# EAGLE design Capstone V7 (EAGLE 9.6.2)
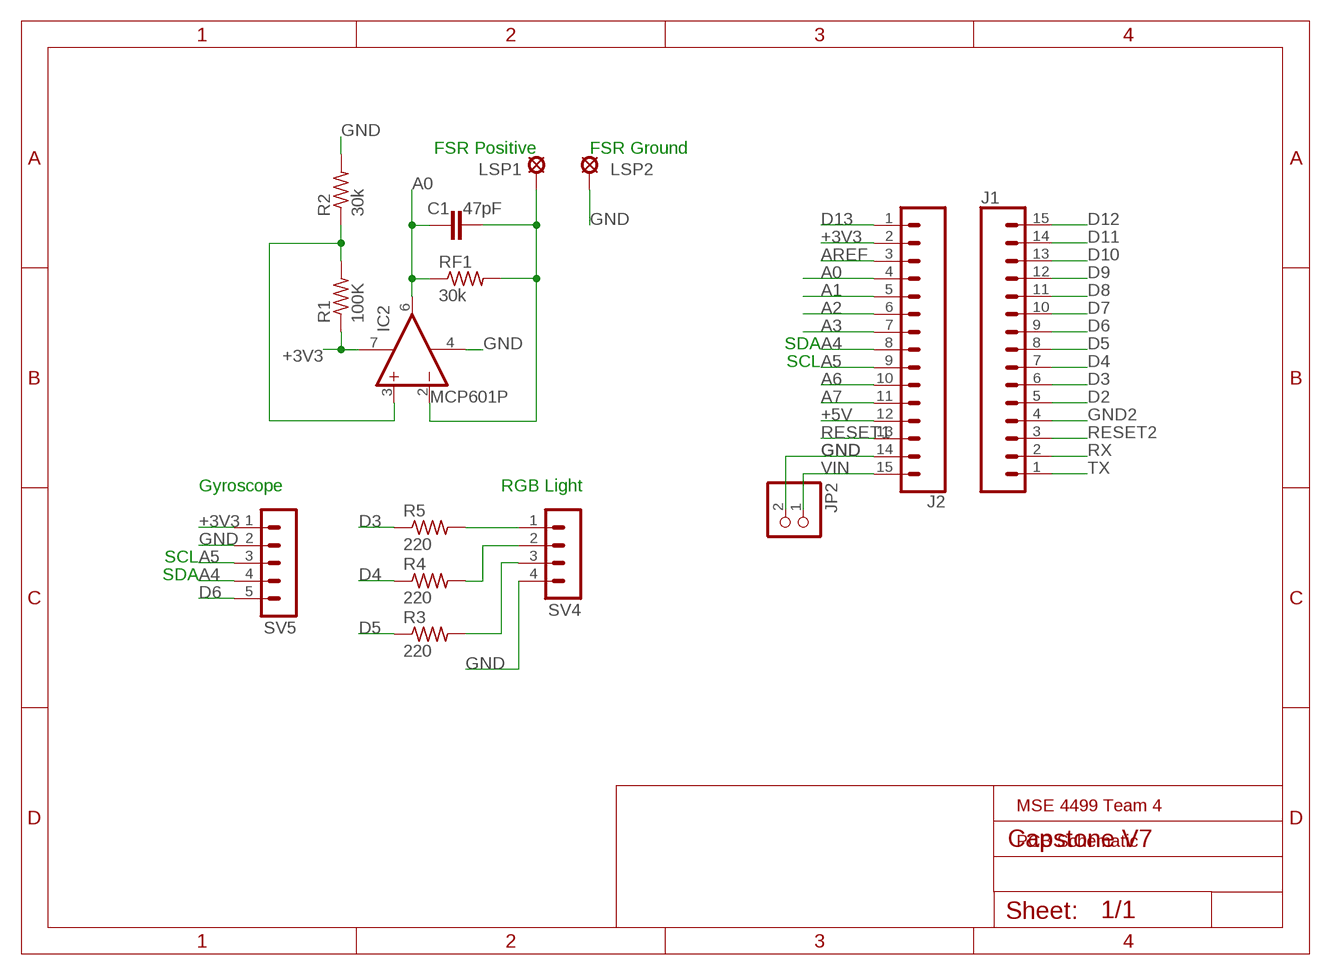
[diagram p0: schematic, sheet 1]

## Parts
C1  47pF  C2,5-3  [C2.5-3]
IC2  MCP601P  [DIL08]
J1  CONN_15  [1X15]
J2  CONN_15  [1X15]
JP2  PINHD-1X2  [1X02]
LSP1  LSP10  [LSP10]
LSP2  LSP10  [LSP10]
R1  100K  R-US_0204/7  [0204/7]
R2  30k  R-US_0204/7  [0204/7]
R3  220  R-US_0204/7  [0204/7]
R4  220  R-US_0204/7  [0204/7]
R5  220  R-US_0204/7  [0204/7]
RF1  30k  R-US_0204/7  [0204/7]
SV4  MA04-1  [MA04-1]
SV5  MA05-1  [MA05-1]

## Nets
+3V3: IC2.7(V+) J2.2 R1.1 SV5.1
+5V: J2.12
A0: C1.1 IC2.6(OUT) J2.4 RF1.1
A1: J2.5
A2: J2.6
A3: J2.7
A4: J2.8 SV5.4
A5: J2.9 SV5.3
A6: J2.10
A7: J2.11
AREF: J2.3
D2: J1.5
D3: J1.6 R5.1
D4: J1.7 R4.1
D5: J1.8 R3.1
D6: J1.9 SV5.5
D7: J1.10
D8: J1.11
D9: J1.12
D10: J1.13
D11: J1.14
D12: J1.15
D13: J2.1
GND: IC2.4(V-) J2.14 JP2.2 LSP2.MP R2.2 SV4.4 SV5.2
GND2: J1.4
N$1: R5.2 SV4.1
N$2: IC2.3(+IN) R1.2 R2.1
N$3: R4.2 SV4.2
N$5: R3.2 SV4.3
N$6: C1.2 IC2.2(-IN) LSP1.MP RF1.2
RESET1: J2.13
RESET2: J1.3
RX: J1.2
TX: J1.1
VIN: J2.15 JP2.1

## Notes on the sheet
- FSR Positive | FSR Ground
- SDA
- SCL
- Gyroscope | RGB Light
- SCL
- SDA
- MSE 4499 Team 4
- PCB Schematic

## Library data of the parts
C1 = capacitor-wima:C: CAPACITOR naming: grid - package width
IC2 = linear:MCP601: Single Op Amp 2.7V to 6.0V Single Supply CMOS Source: http://ww1.microchip.com/downloads/en/DeviceDoc/21314g.pdf
J1 J2 = SparkFun-Connectors:CONN_15: Multi connection point. Often used as Generic Header-pin footprint for 0.1 inch spaced/style header connections On any of the 0.1 inch spaced packages, you can populate with these: Break Away Headers - Straight <https://www.sparkfun.com/products/116> (PRT-00116) Break Away Male Headers - Right Angle <https://www.sparkfun.com/products/553> (PRT-00553) Female Headers <https://www.sparkfun.com/products/115> (PRT-00115) Break Away Headers - Machine Pin <https://www.sparkfun.com/products/117> (PRT-00117) Break Away Female Headers - Swiss Machine Pin <https://www.sparkfun.com/products/743> (PRT-00743) For SCREWTERMINALS and SPRING TERMINALS visit here: Screw Terimnals on SparkFun.com <https://www.sparkfun.com/search/results?term=Screw+Terminals> (5mm/3.5mm/2.54mm spacing) This device is also useful as a general connection point to wire up your design to another part of your project. Our various solder wires solder well into these plated through hole pads. Hook-Up Wire - Assortment (Stranded, 22 AWG) <https://www.sparkfun.com/products/11375> (PRT-11375) Hook-Up Wire - Assortment (Solid Core, 22 AWG) <https://www.sparkfun.com/products/11367> (PRT-11367) View the entire wire category on our website here <https://www.sparkfun.com/categories/141> Special notes: Molex polarized connector foot print use with SKU : PRT-08231 with associated crimp pins and housings. 1MM SMD Version SKU: PRT-10208 NOTES ON THE VARIANTS LOCK and LOCK_LONGPADS... This footprint was designed to help hold the alignment of a through-hole component (i.e. 6-pin header) while soldering it into place. You may notice that each hole has been shifted either up or down by 0.005 of an inch from it's more standard position (which is a perfectly straight line). This slight alteration caused the pins (the squares in the middle) to touch the edges of the holes. Because they are alternating, it causes a "brace" to hold the component in place. 0.005 has proven to be the perfect amount of "off-center" position when using our standard breakaway headers. Although looks a little odd when you look at the bare footprint, once you have a header in there, the alteration is very hard to notice. Also,if you push a header all the way into place, it is covered up entirely on the bottom side.
JP2 = pinhead:PINHD-1X2: PIN HEADER
LSP1 LSP2 = solpad:LSP10: SOLDER PAD drill 1.0 mm, distributor Buerklin, 12H555
R1-R5 RF1 = resistor:R-US_: RESISTOR, American symbol
SV4 = con-lstb:MA04-1: PIN HEADER; OC_FARNELL: unknown; OC_NEWARK: unknown
SV5 = con-lstb:MA05-1: PIN HEADER; OC_FARNELL: unknown; OC_NEWARK: unknown

## Net classes
0 default: width 0.19 mm, drill 0.19 mm

## Board
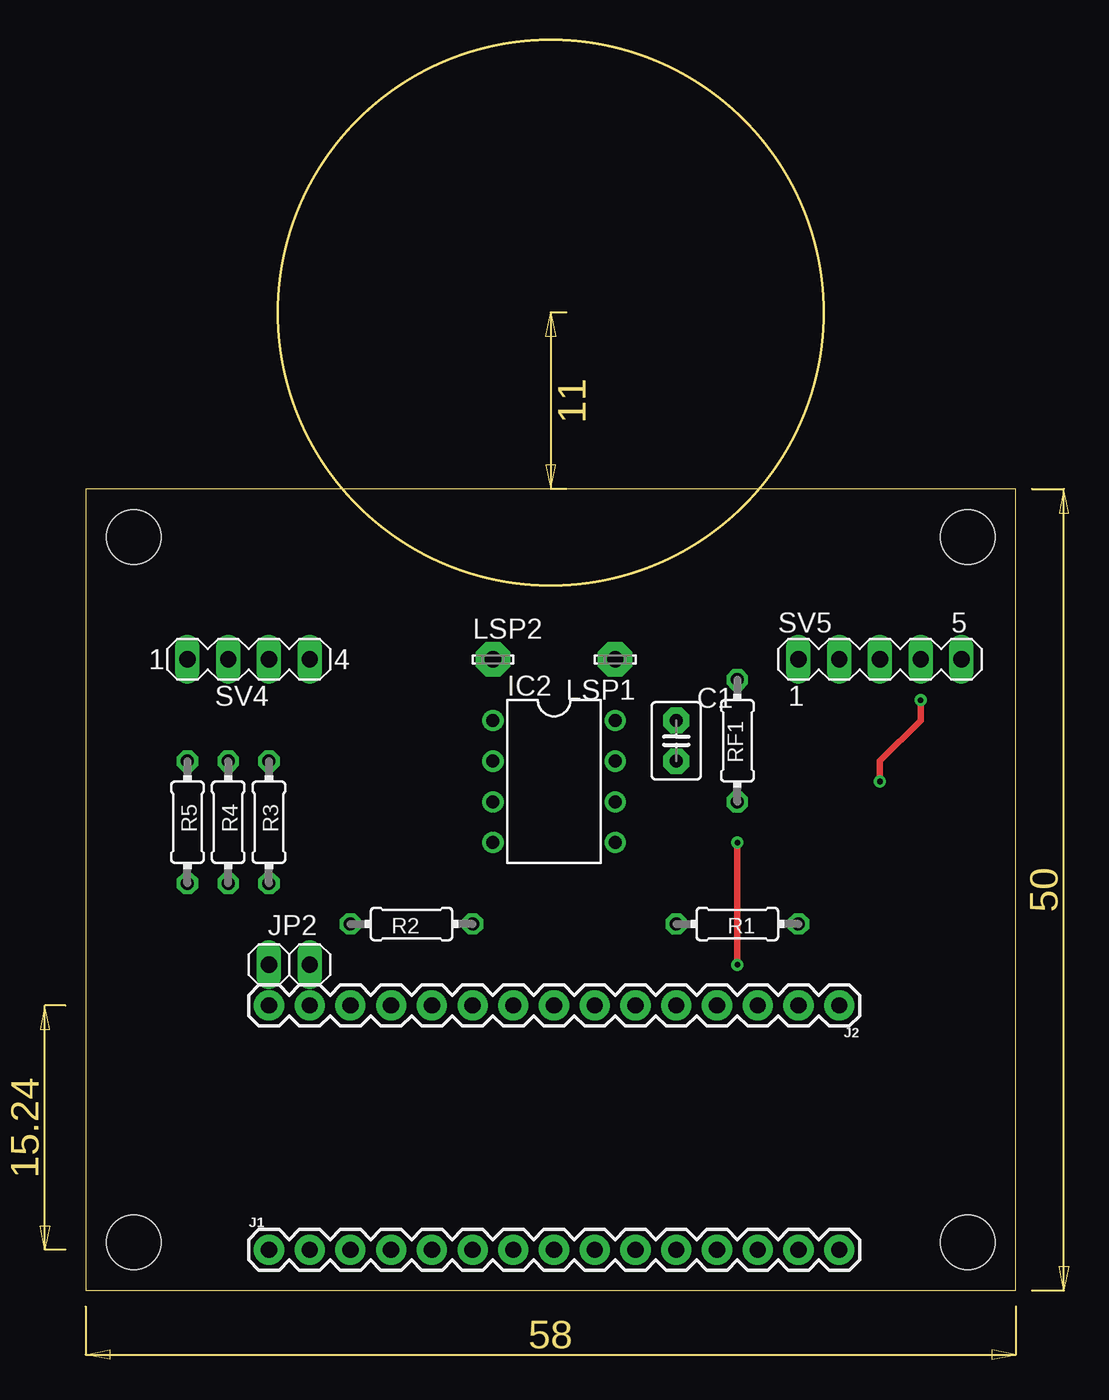
[diagram p1: board, top side]
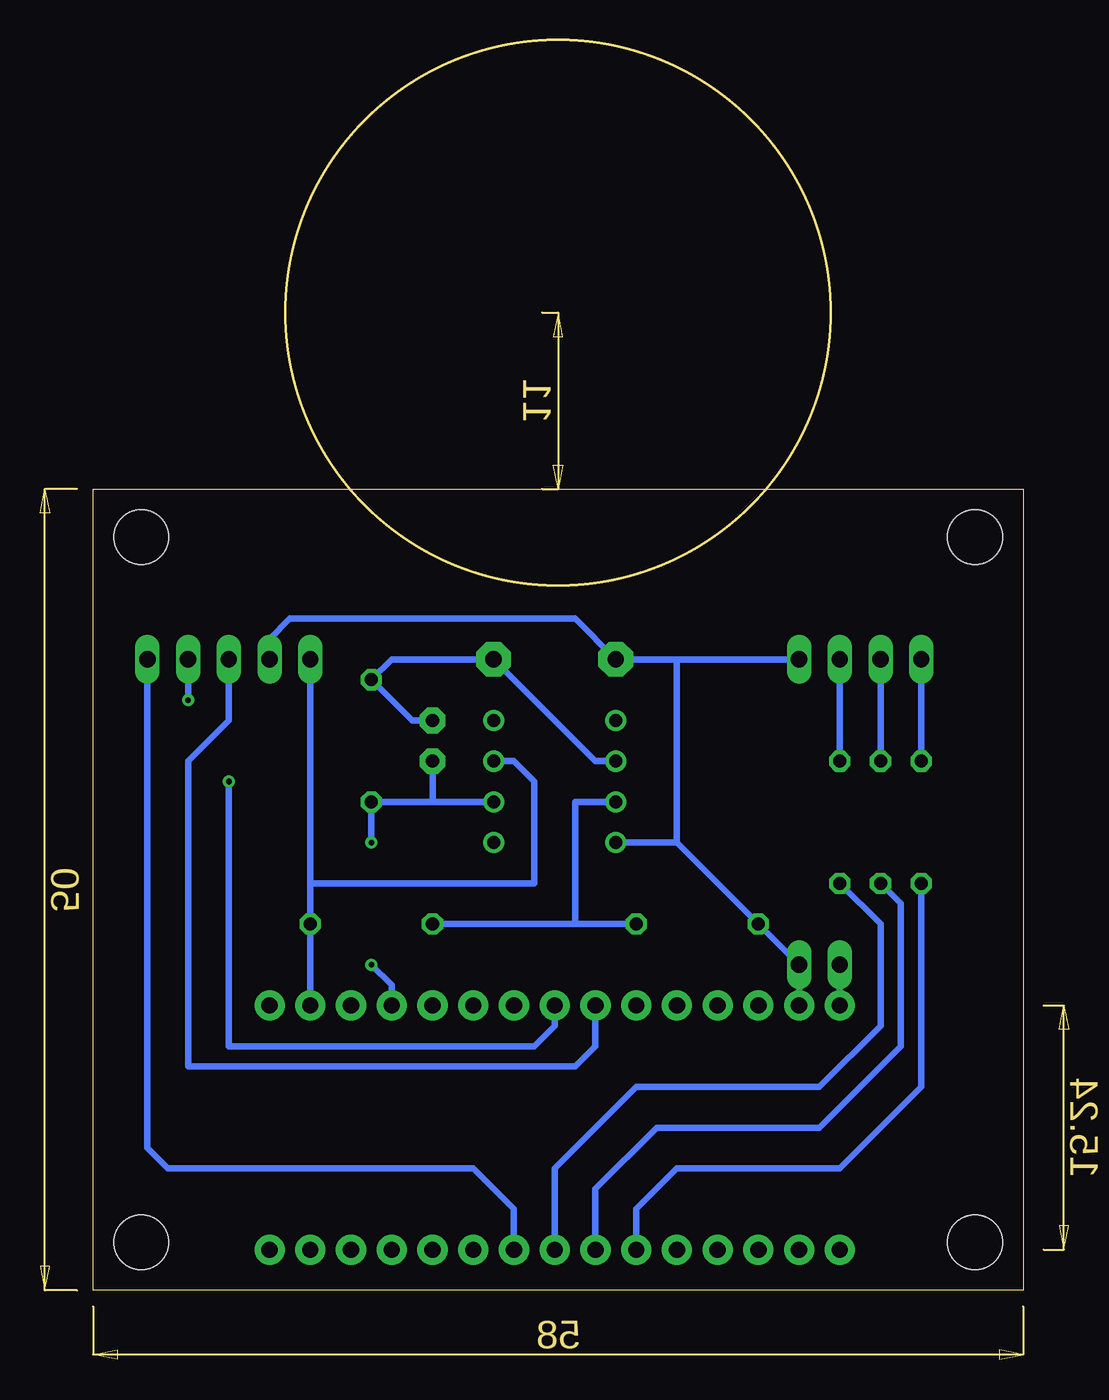
[diagram p2: board, bottom side, seen from below]

Size 58 x 78 mm. Coordinates in mm from the lower left corner, seen from the top.
Outline: 0,0 58,0 58,50 0,50 0,0
Outline: circle at 29,61 radius 17
Copper layers (1*16): Top 0.035mm / dielectric 1.5mm / Bottom 0.035mm
Design rules "default *": minimum track width 6mil, minimum drill 0.35mm, track to track 6mil, track to pad 6mil, pad to pad 6mil, via to via 6mil, smd to smd 6mil, copper to edge 40mil, drill to drill 6mil, minimum pad ring 10mil, minimum via ring 8mil, stop-mask expansion 4mil, vias tented up to drill 0mil, thermal gap 10mil
Holes 3.4 mm at 3,47 55,47 55,3 3,3
Holes 34 mm at 29,61

### Footprints (pad centres in the part's own frame; a part is rotated, then mirrored left to right if it is on the bottom)
C2.5-3 = drill 0.813 pad 1.6 octagon: 1 -1.27,0; 2 1.27,0
DIL08 = drill 0.813 pad 1.27: 1 -3.81,-3.81; 2 -1.27,-3.81; 3 1.27,-3.81; 4 3.81,-3.81; 5 3.81,3.81; 6 1.27,3.81; 7 -1.27,3.81; 8 -3.81,3.81
1X15 = drill 1.016 pad 1.88: 1 0,0; 2 2.54,0; 3 5.08,0; 4 7.62,0; 5 10.16,0; 6 12.7,0; 7 15.24,0; 8 17.78,0; 9 20.32,0; 10 22.86,0; 11 25.4,0; 12 27.94,0; 13 30.48,0; 14 33.02,0; 15 35.56,0
1X02 = drill 1.016 long: 1 -1.27,0; 2 1.27,0
LSP10 = drill 1.016 pad 2.159 octagon: MP 0,0
0204/7 = drill 0.813 octagon: 1 -3.81,0; 2 3.81,0
MA04-1 = drill 1.016 long: 1 -3.81,0; 2 -1.27,0; 3 1.27,0; 4 3.81,0
MA05-1 = drill 1.016 long: 1 -5.08,0; 2 -2.54,0; 3 0,0; 4 2.54,0; 5 5.08,0

### Placement (x,y rotation side)
C1  36.83,34.29 90 top
IC2  29.21,31.75 270 top
J1  11.43,2.54 0 top
J2  46.99,17.78 180 top
JP2  12.7,20.32 0 top
LSP1  33.02,39.37 0 top
LSP2  25.4,39.37 0 top
R1  40.64,22.86 180 top
R2  20.32,22.86 180 top
R3  11.43,29.21 90 top
R4  8.89,29.21 90 top
R5  6.35,29.21 90 top
RF1  40.64,34.29 90 top
SV4  10.16,39.37 0 top
SV5  49.53,39.37 0 top

### Tracks (layer width: path | path; a pad name or v marks a point on that pad's centre or on a via)
+3V3
  Bottom 0.406: 44.45,25.4 30.48,25.4 30.48,31.75 31.75,33.02 IC2.7 | J2.2 R1.1 44.45,25.4 | 44.45,25.4 SV5.1
A0  (via drill 0.35)
  Top 0.406: v40.64,27.94 v40.64,20.32
  Bottom 0.406: J2.4 39.37,19.05 v40.64,20.32 | IC2.6 36.83,30.48 | 36.83,30.48 RF1.1 v40.64,27.94 | C1.1 36.83,30.48
A4  (via drill 0.35)
  Top 0.406: v52.07,36.83 52.07,35.56 49.53,33.02 v49.53,31.75
  Bottom 0.406: J2.8 29.21,16.51 30.48,15.24 49.53,15.24 v49.53,31.75 | SV5.4 v52.07,36.83
A5
  Bottom 0.406: J2.9 26.67,15.24 27.94,13.97 52.07,13.97 52.07,33.02 49.53,35.56 SV5.3
D3
  Bottom 0.406: R5.1 6.35,12.7 11.43,7.62 21.59,7.62 24.13,5.08 J1.6
D4
  Bottom 0.406: R4.1 7.62,24.13 7.62,15.24 12.7,10.16 22.86,10.16 26.67,6.35 J1.7
D5
  Bottom 0.406: R3.1 8.89,22.86 8.89,16.51 12.7,12.7 24.13,12.7 29.21,7.62 J1.8
D6
  Bottom 0.406: J1.9 31.75,5.08 34.29,7.62 53.34,7.62 54.61,8.89 SV5.5
GND
  Bottom 0.406: J2.14 JP2.2 R2.2 21.59,27.94 | SV4.4 21.59,39.37 | 21.59,39.37 LSP2.MP 27.94,41.91 45.72,41.91 46.99,40.64 SV5.2 | 21.59,27.94 IC2.4 | 21.59,27.94 21.59,39.37
N$1
  Bottom 0.406: R5.2 SV4.1
N$2
  Bottom 0.406: R2.1 27.94,22.86 | 27.94,22.86 R1.2 | IC2.3 27.94,30.48 27.94,22.86
N$3
  Bottom 0.406: R4.2 SV4.2
N$5
  Bottom 0.406: R3.2 SV4.3
N$6
  Bottom 0.406: IC2.2 26.67,33.02 LSP1.MP 39.37,39.37 RF1.2 38.1,35.56 C1.2
VIN
  Bottom 0.406: JP2.1 J2.15